# EAGLE design DMX-Switch (EAGLE 7.6.0)
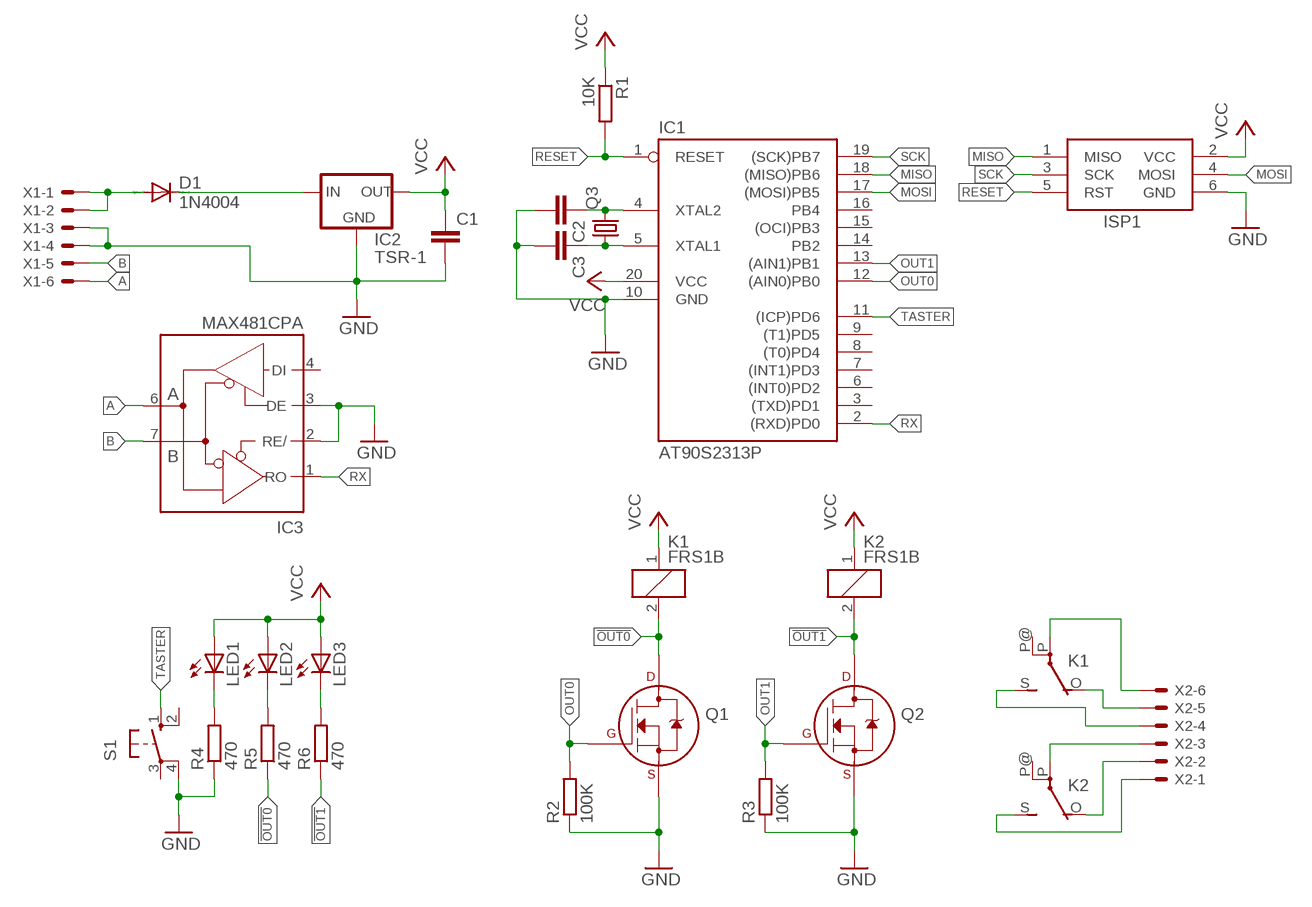
[diagram p0: schematic, sheet 1]

## Parts
C1  C-EU025-024X044  [C025-024X044]
C2  C-EU025-024X044  [C025-024X044]
C3  C-EU025-024X044  [C025-024X044]
D1  1N4004  [DO41-10]
IC1  AT90S2313P  [DIL20]
IC2  TSR-1  [TSR-1]
IC3  MAX481CPA  [DIL08]
ISP1  AVRISP-BOX  [AVRISP-BOX]
K1  FRS1B  [FRS1B]
K2  FRS1B  [FRS1B]
LED1  LED5MM  [LED5MM]
LED2  LED5MM  [LED5MM]
LED3  LED5MM  [LED5MM]
Q1  2N7000_TO92  [TO-92]
Q2  2N7000_TO92  [TO-92]
Q3  CRYSTALHC49S  [HC49/S]
R1  10K  R-EU_0204/7  [0204/7]
R2  100K  R-EU_0204/7  [0204/7]
R3  100K  R-EU_0204/7  [0204/7]
R4  470  R-EU_0204/7  [0204/7]
R5  470  R-EU_0204/7  [0204/7]
R6  470  R-EU_0204/7  [0204/7]
S1  10-XX  [B3F-10XX]
X1  KK-156-6  [KK-156-6]
X2  KK-156-6  [KK-156-6]

## Nets
!OUT0: K1.2 Q1.3(D) R5.1
!OUT1: K2.2 Q2.3(D) R6.1
A: IC3.6(A) X1.6
B: IC3.7(B) X1.5
GND: C1.2 C2.2 C3.2 IC1.10(GND) IC2.2(GND) IC3.2(RE/) IC3.3(DE) ISP1.6(GND) Q1.1(S) Q2.1(S) R2.1 R3.1 R4.1 S1.4(P1) X1.3 X1.4
MISO: IC1.18((MISO)PB6) ISP1.1(MISO)
MOSI: IC1.17((MOSI)PB5) ISP1.4(MOSI)
N$1: D1.A X1.1 X1.2
N$2: D1.C IC2.1(IN)
N$3: C3.1 IC1.5(XTAL1) Q3.1
N$4: C2.1 IC1.4(XTAL2) Q3.2
N$5: LED1.K(C) R4.2
N$6: LED2.K(C) R5.2
N$7: LED3.K(C) R6.2
N$8: K1.S(2:S) X2.4
N$9: K1.O(2:O) X2.5
N$10: K1.P(2:P) X2.6
N$11: K2.P(2:P) X2.3
N$12: K2.O(2:O) X2.2
N$13: K2.S(2:S) X2.1
OUT0: IC1.12((AIN0)PB0) Q1.2(G) R2.2
OUT1: IC1.13((AIN1)PB1) Q2.2(G) R3.2
RESET: IC1.1(RESET) ISP1.5(RST) R1.2
RX: IC1.2((RXD)PD0) IC3.1(RO)
SCK: IC1.19((SCK)PB7) ISP1.3(SCK)
TASTER: IC1.11((ICP)PD6) S1.1(S)
VCC: C1.1 IC1.20(VCC) IC2.3(OUT) ISP1.2(VCC) K1.1 K2.1 LED1.A LED2.A LED3.A R1.1
Unconnected: IC1.3((TXD)PD1) IC1.6((INT0)PD2) IC1.7((INT1)PD3) IC1.8((T0)PD4) IC1.9((T1)PD5) IC1.14(PB2) IC1.15((OCI)PB3) IC1.16(PB4) IC3.4(DI) K1.P@(2:P) K2.P@(2:P) S1.2(S1) S1.3(P)

## Power pins joined to a net without a drawn wire
GND: IC3.5(GND)
VCC: IC3.8(VCC)

## Library data of the parts
C1-C3 = resistor:C-EU: CAPACITOR, European symbol
D1 = diode:1N4004: DIODE general purpose rectifier, 1 A
IC1 = atmel:AT90S2313: MICROCONTROLLER 2 Kbytes FLASH 128 bytes SRAM 128 bytes EEPROM UART; OC_FARNELL: unknown; OC_NEWARK: unknown
IC2 = traco-electronic2:TSR-1: DC/DC Converters - TSR-1 Series, 1 A Features: ◆ Up to 96 % efficiency – No heat-sink required ◆ Pin compatible with LMxx linear regulators ◆ SIP-package fits existing TO-220 footprint ◆ Built in filter capacitors ◆ Operation temp. range –40°C to +85°C ◆ Short circuit protection ◆ Wide input operating range ◆ Excellent line / load regulation ◆ Low standby current ◆ 3-year product warranty The new TSR-1 series step-down switching regulators are drop-in replacement for inefficient 78xx linear regulators. A high efficiency up to 96 % allows full load operation up to +60°C ambient temperature without the need of any heat-sink or forced cooling. The TSR-1 switching regulators provide other significant features over linear regulators, i.e. better output accuracy (±2 %), lower standby current of 2 mA and no requirement of external capacitors. The high efficiency and low standby power consumption makes these regulators an ideal solution for many battery powered applications. For input voltage higher than 32 VDC an input capcitor 22uF / 50 V is required.
IC3 = maxim:MAX481CPA: RS485 TRANSEIVER; MPN: MAX481CPA+; OC_FARNELL: unknown; OC_NEWARK: 99K3445
ISP1 = adafruit:AVRISP: AVR ISP HEADER Standard 6 pin header for AVR programming
K1 K2 = relay:FRS1B: RELAY 1 x switch, same as V23101-D6-A201, Siemens; OC_FARNELL: unknown; OC_NEWARK: unknown
LED1-LED3 = led:LED: LED OSRAM: - CHIPLED LG R971, LG N971, LY N971, LG Q971, LY Q971, LO R971, LY R971 LH N974, LH R974 LS Q976, LO Q976, LY Q976 LO Q996 - Hyper CHIPLED LW Q18S LB Q993, LB Q99A, LB R99A - SideLED LS A670, LO A670, LY A670, LG A670, LP A670 LB A673, LV A673, LT A673, LW A673 LH A674 LY A675 LS A676, LA A676, LO A676, LY A676, LW A676 LS A679, LY A679, LG A679 - Hyper Micro SIDELED® LS Y876, LA Y876, LO Y876, LY Y876 LT Y87S - SmartLED LW L88C, LW L88S LB L89C, LB L89S, LG L890 LS L89K, LO L89K, LY L89K LS L896, LA L896, LO L896, LY L896 - TOPLED LS T670, LO T670, LY T670, LG T670, LP T670 LSG T670, LSP T670, LSY T670, LOP T670, LYG T670 LG T671, LOG T671, LSG T671 LB T673, LV T673, LT T673, LW T673 LH T674 LS T676, LA T676, LO T676, LY T676, LB T676, LH T676, LSB T676, LW T676 LB T67C, LV T67C, LT T67C, LS T67K, LO T67K, LY T67K, LW E67C LS E67B, LA E67B, LO E67B, LY E67B, LB E67C, LV E67C, LT E67C LW T67C LS T679, LY T679, LG T679 LS T770, LO T770, LY T770, LG T770, LP T770 LB T773, LV T773, LT T773, LW T773 LH T774 LS E675, LA E675, LY E675, LS T675 LS T776, LA T776, LO T776, LY T776, LB T776 LHGB T686 LT T68C, LB T68C - Hyper Mini TOPLED® LB M676 - Mini TOPLED Santana® LG M470 LS M47K, LO M47K, LY M47K Source: http://www.osram.convergy.de LUXEON: - LUMILED® LXK2-PW12-R00, LXK2-PW12-S00, LXK2-PW14-U00, LXK2-PW14-V00 LXK2-PM12-R00, LXK2-PM12-S00, LXK2-PM14-U00 LXK2-PE12-Q00, LXK2-PE12-R00, LXK2-PE12-S00, LXK2-PE14-T00, LXK2-PE14-U00 LXK2-PB12-K00, LXK2-PB12-L00, LXK2-PB12-M00, LXK2-PB14-N00, LXK2-PB14-P00, LXK2-PB14-Q00 LXK2-PR12-L00, LXK2-PR12-M00, LXK2-PR14-Q00, LXK2-PR14-R00 LXK2-PD12-Q00, LXK2-PD12-R00, LXK2-PD12-S00 LXK2-PH12-R00, LXK2-PH12-S00 LXK2-PL12-P00, LXK2-PL12-Q00, LXK2-PL12-R00 Source: www.luxeon.com KINGBRIGHT: KA-3528ASYC Source: www.kingbright.com
Q1 Q2 = transistors:2N700*: 2N7000, 2N7002, NDS7002A N-channel enhancement mode MOSFET
Q3 = crystal:CRYSTAL: CRYSTAL; OC_FARNELL: 1667008; OC_NEWARK: unknown
R1-R6 = resistor:R-EU_: RESISTOR, European symbol
S1 = switch-omron:10-XX: OMRON SWITCH; MPN: B3F-1000; OC_FARNELL: 176432; OC_NEWARK: 36M3542
X1 X2 = con-molex:KK-156-6: KK 156 HEADER Source: http://www.molex.com/pdm_docs/sd/026604100_sd.pdf; OC_FARNELL: unknown; OC_NEWARK: unknown

## Board
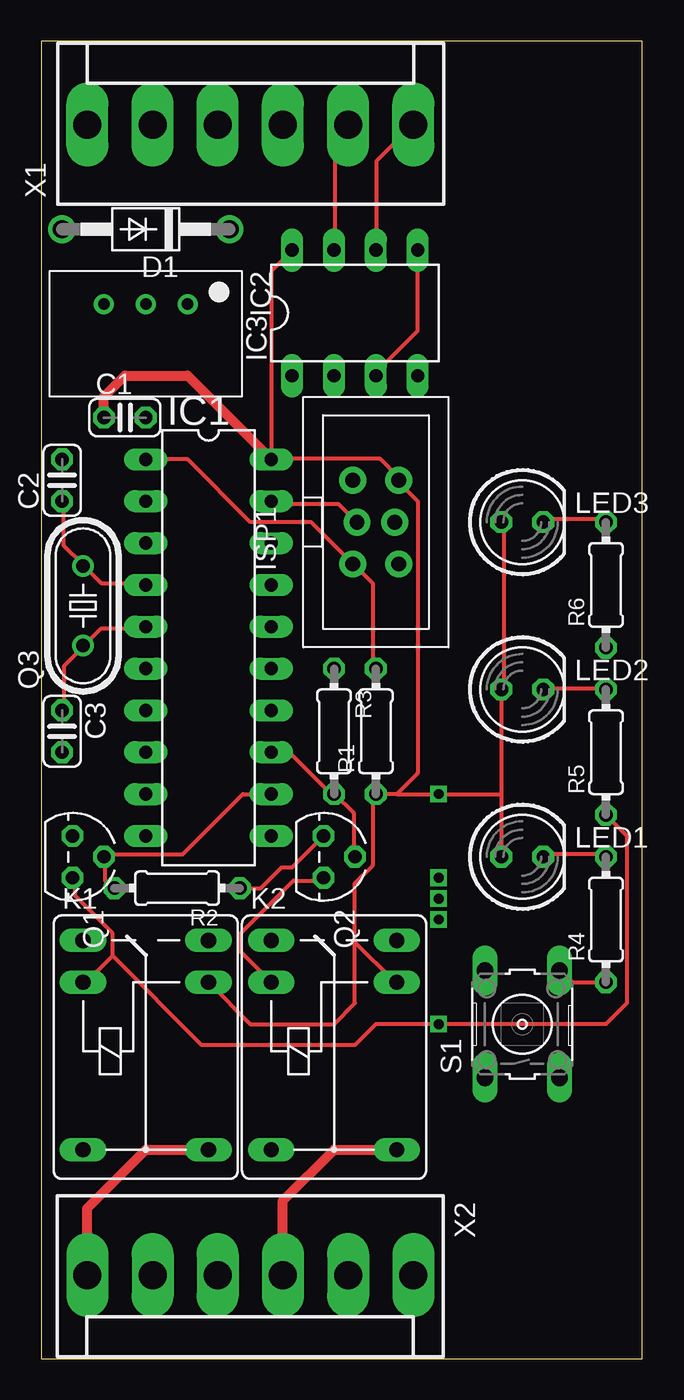
[diagram p1: board, top side]
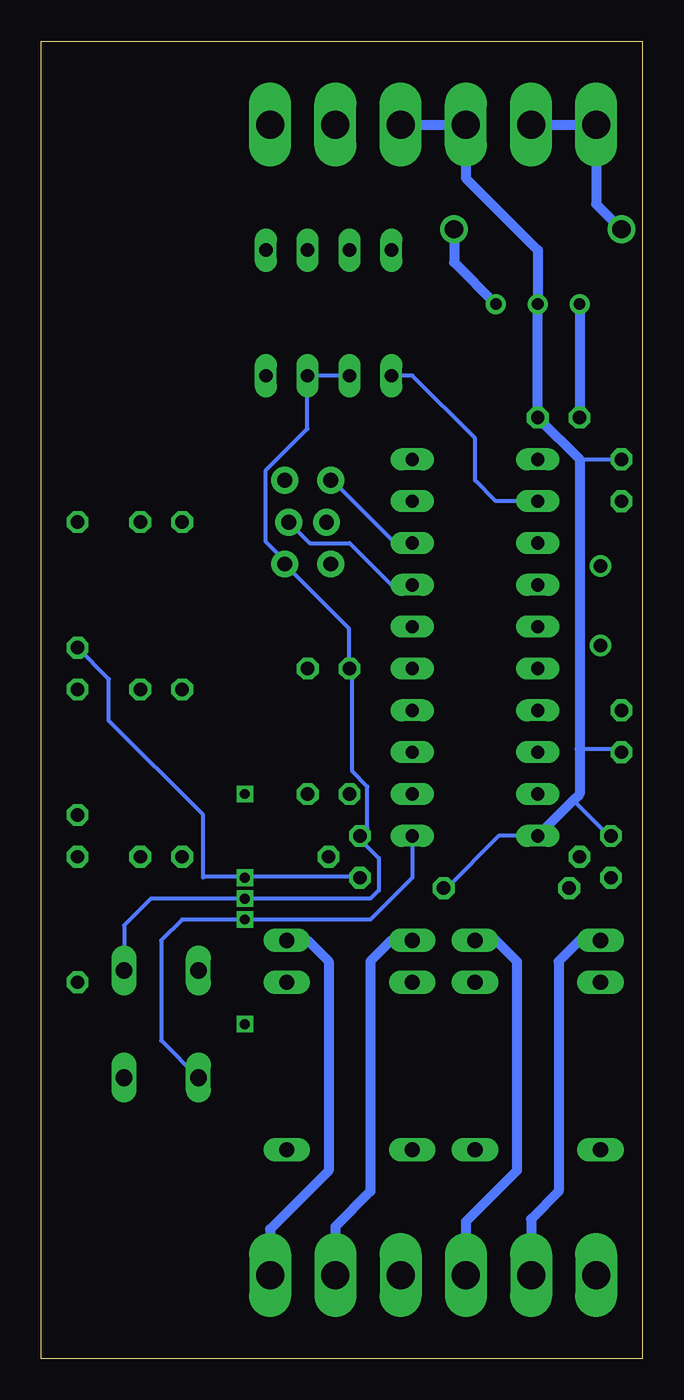
[diagram p2: board, bottom side, seen from below]

Size 36.5 x 80 mm. Coordinates in mm from the lower left corner, seen from the top.
Outline: 0,0 36.5,0 36.5,80 0,80 0,0
Copper layers (1*16): Top 0.035mm / dielectric 1.5mm / Bottom 0.035mm
Design rules "default": minimum track width 10mil, minimum drill 24mil, track to track 8mil, track to pad 8mil, pad to pad 8mil, via to via 8mil, smd to smd 8mil, copper to edge 40mil, drill to drill 8mil, minimum pad ring 10mil, minimum via ring 8mil, stop-mask expansion 4mil, vias tented up to drill 0mil, thermal gap 10mil

### Footprints (pad centres in the part's own frame; a part is rotated, then mirrored left to right if it is on the bottom)
C025-024X044 = drill 0.813 octagon: 1 -1.27,0; 2 1.27,0
DO41-10 = drill 1.118: A 5.08,0; C -5.08,0
DIL20 = drill 0.813 long: 1 -11.43,-3.81; 2 -8.89,-3.81; 3 -6.35,-3.81; 4 -3.81,-3.81; 5 -1.27,-3.81; 6 1.27,-3.81; 7 3.81,-3.81; 8 6.35,-3.81; 9 8.89,-3.81; 10 11.43,-3.81; 11 11.43,3.81; 12 8.89,3.81; 13 6.35,3.81; 14 3.81,3.81; 15 1.27,3.81; 16 -1.27,3.81; 17 -3.81,3.81; 18 -6.35,3.81; 19 -8.89,3.81; 20 -11.43,3.81
TSR-1 = drill 0.7: 1 -2.54,-1.8; 2 0,-1.8; 3 2.54,-1.8
DIL08 = drill 0.813 long: 1 -3.81,-3.81; 2 -1.27,-3.81; 3 1.27,-3.81; 4 3.81,-3.81; 5 3.81,3.81; 6 1.27,3.81; 7 -1.27,3.81; 8 -3.81,3.81
AVRISP-BOX = drill 0.9 pad 1.626: 1 -1.397,2.54; 2 1.397,2.54; 3 -1.143,0; 4 1.143,0; 5 -1.397,-2.54; 6 1.397,-2.54
FRS1B = drill 0.914 long: 1 0,3.81; 2 0,-3.81; O -2.54,-3.81; P 10.16,3.81; P@ 10.16,-3.81; S -2.54,3.81
LED5MM = drill 0.813 octagon: A -1.27,0; K 1.27,0
TO-92 = drill 0.813 octagon: 1 -1.27,0; 2 0,1.905; 3 1.27,0
HC49/S = drill 0.813: 1 -2.413,0; 2 2.413,0
0204/7 = drill 0.813 octagon: 1 -3.81,0; 2 3.81,0
B3F-10XX = drill 1.016 long: 1 -3.251,2.261; 2 3.251,2.261; 3 -3.251,-2.261; 4 3.251,-2.261
KK-156-6 = drill 1.7 pad 2.184 long: 1 -9.9,0; 2 -5.94,0; 3 -1.98,0; 4 1.98,0; 5 5.94,0; 6 9.9,0

### Placement (x,y rotation side)
C1  5.08,57.15 0 top
C2  1.27,53.34 90 top
C3  1.27,38.1 270 top
D1  6.35,68.58 180 top
IC1  10.16,43.18 270 top
IC2  6.35,62.23 180 top
IC3  19.05,63.5 0 top
ISP1  20.32,50.8 0 top
K1  6.35,22.86 270 top
K2  17.78,22.86 270 top
LED1  29.21,30.48 0 top
LED2  29.21,40.64 0 top
LED3  29.21,50.8 0 top
Q1  1.91,30.48 270 top
Q2  17.14,30.48 270 top
Q3  2.54,45.72 90 top
R1  20.32,38.1 90 top
R2  8.26,28.57 180 top
R3  17.78,38.1 270 top
R4  34.29,26.67 90 top
R5  34.29,36.83 90 top
R6  34.29,46.99 90 top
S1  29.21,20.32 90 top
X1  12.7,74.93 0 top
X2  12.7,5.08 180 top

### Tracks (layer width: path | path; a pad name or v marks a point on that pad's centre or on a via)
!OUT0  (via drill 0.6)
  Top 0.254: 4.34,24.46 4.34,25.83 2.06,28.12 2.06,29.03 Q1.3 | 4.34,24.46 2.74,22.86 K1.2 | R5.1 35.56,31.75 35.56,21.59 34.29,20.32 v24.13,20.32 20.32,20.32 19.05,19.05 9.75,19.05 4.34,24.46
!OUT1
  Top 0.254: Q2.3 17.14,29.03 15.32,29.03 12.12,25.83 12.12,24.71 K2.2
  Bottom 0.254: 34.29,42.98 R6.1 32.38,41.27 32.38,38.73 26.67,33.02 26.67,29.21 26.62,29.26 17.14,29.26 Q2.3
A
  Top 0.254: IC3.6 20.34,67.44 20.34,72.69 22.4,74.75 X1.6
B
  Top 0.254: IC3.7 17.83,67.44 17.83,74.07 18.52,74.75 X1.5
GND  (via drill 0.6)
  Top 0.254: IC3.5 22.86,62.41 20.34,59.89 IC3.3 | R4.1 32.23,22.86 31.55,23.55 S1.4 | R2.1 13.34,28.57 14.61,29.84 15.24,29.84 Q2.1
  Bottom 0.254: 3.81,54.61 C2.2 | IC3.2 IC3.3 20.34,59.66 20.34,56.46 22.86,53.95 22.86,49.61 21.72,48.46 ISP1.6 21.72,48.23 17.83,44.35 17.83,42.06 R3.1 17.6,41.83 17.6,35.66 16.69,34.75 16.69,32.23 17.14,31.77 Q2.1 17.14,31.55 16,30.4 16,28.45 16.51,27.94 v24.13,27.94 29.84,27.94 31.47,26.31 S1.4 | 4.19,33.91 2.06,31.77 Q1.1 | 3.81,37.03 1.37,37.03 C3.2 | IC1.10 6.63,31.77 8.69,31.77 11.89,28.57 R2.1
  Bottom 0.61: X1.4 X1.3 10.72,71.68 6.35,67.31 IC2.2 C1.2 3.81,54.61 3.81,37.03 3.81,34.29 4.19,33.91 IC1.10
MISO
  Bottom 0.254: IC1.18 14.17,49.61 15.09,49.61 18.75,53.26 ISP1.1
MOSI
  Bottom 0.254: ISP1.4 20.19,49.53 17.78,49.53 15.24,46.99 IC1.17
N$1
  Bottom 0.61: X1.2 X1.1 2.8,70.11 D1.A
N$2
  Bottom 0.61: D1.C 11.43,66.57 IC2.1
N$3
  Top 0.254: C3.1 1.37,39.55 1.37,42.06 2.52,43.2 Q3.1 2.74,43.43 3.66,44.35 6.17,44.35 IC1.5
N$4
  Top 0.254: C2.1 1.37,51.89 1.37,49.38 2.52,48.23 Q3.2 2.74,48.01 3.66,47.09 6.17,47.09 IC1.4
N$5
  Top 0.254: LED1.K 30.63,30.63 34.29,30.63 R4.2
N$6
  Top 0.254: LED2.K 30.63,40.69 34.29,40.69 R5.2
N$7
  Top 0.254: LED3.K 30.63,50.98 34.29,50.98 R6.2
N$8
  Bottom 0.61: K1.S 8.89,25.4 7.62,24.13 7.62,11.43 10.72,8.33 X2.4
N$9
  Bottom 0.61: K1.O 3.81,25.4 5.08,24.13 5.08,10.16 6.76,8.48 X2.5
N$10
  Top 0.61: X2.6 2.8,9.15 6.35,12.7 K1.P
N$11
  Top 0.61: X2.3 14.68,9.6 17.78,12.7 K2.P
N$12
  Bottom 0.61: K2.O 15.24,25.4 16.51,24.13 16.51,10.16 18.64,8.03 X2.2
N$13
  Bottom 0.61: K2.S 20.32,25.4 19.05,24.13 19.05,11.43 22.6,7.88 X2.1
N$14  (via drill 0.6)
  other vias: 24.13,29.21
OUT0
  Top 0.254: R2.2 4.34,28.57 3.89,29.03 3.89,30.4 Q1.2 3.89,30.63 8.59,30.63 12.24,34.29 IC1.12
OUT1
  Top 0.254: IC1.13 14.17,36.8 15.09,36.8 17.6,34.29 R3.2 17.83,34.29 18.97,33.15 18.97,30.63 Q2.2
RESET
  Top 0.254: R1.2 20.12,42.06 20.12,47.09 18.97,48.23 ISP1.5 16.38,50.8 12.7,50.8 8.89,54.61 IC1.1
RX
  Bottom 0.254: IC1.2 8.89,52.07 10.16,53.34 10.16,55.88 13.97,59.69 IC3.1
SCK
  Top 0.254: IC1.19 14.17,51.89 18.06,51.89 18.97,50.98 ISP1.3
TASTER  (via drill 0.6)
  Bottom 0.254: IC1.11 13.97,29.21 16.51,26.67 v24.13,26.67 27.94,26.67 29.21,25.4 29.21,19.33 S1.1
VCC  (via drill 0.6)
  Top 0.254: 21.59,34.29 R1.1 20.12,34.29 20.12,29.95 19.05,28.88 19.05,25.3 | LED3.A 28.12,50.75 28.12,40.69 28.07,40.64 LED2.A 27.94,34.29 | IC3.8 13.97,66.04 IC1.20 14.17,54.63 20.57,54.63 21.72,53.49 ISP1.2 21.72,53.21 22.86,52.07 22.86,35.56 21.59,34.29 | K2.1 21.49,22.86 19.05,25.3 | K1.1 12.7,20.32 17.78,20.32 19.05,21.59 19.05,25.3 | 21.59,34.29 v24.13,34.29 27.94,34.29 | 27.94,34.29 LED1.A
  Top 0.61: C1.1 3.81,58.42 5.08,59.69 8.89,59.69 IC1.20
  Bottom 0.61: IC2.3 C1.1